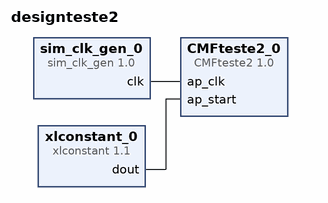
[diagram p0: block diagram of the top level]
# Vivado block design designteste2, xc7z020clg484-1, Vivado 2018.3
create_bd_design designteste2

create_bd_cell -type ip -vlnv xilinx.com:user:CMFteste2:1.0 CMFteste2_0
create_bd_cell -type ip -vlnv xilinx.com:ip:sim_clk_gen:1.0 sim_clk_gen_0
create_bd_cell -type ip -vlnv xilinx.com:ip:xlconstant:1.1 xlconstant_0

# ---- connections ----

connect_bd_net [get_bd_pins sim_clk_gen_0/clk] [get_bd_pins CMFteste2_0/ap_clk]
connect_bd_net [get_bd_pins xlconstant_0/dout] [get_bd_pins CMFteste2_0/ap_start]

validate_bd_design
save_bd_design
